# Altium project Headstage_V003.PrjPcb
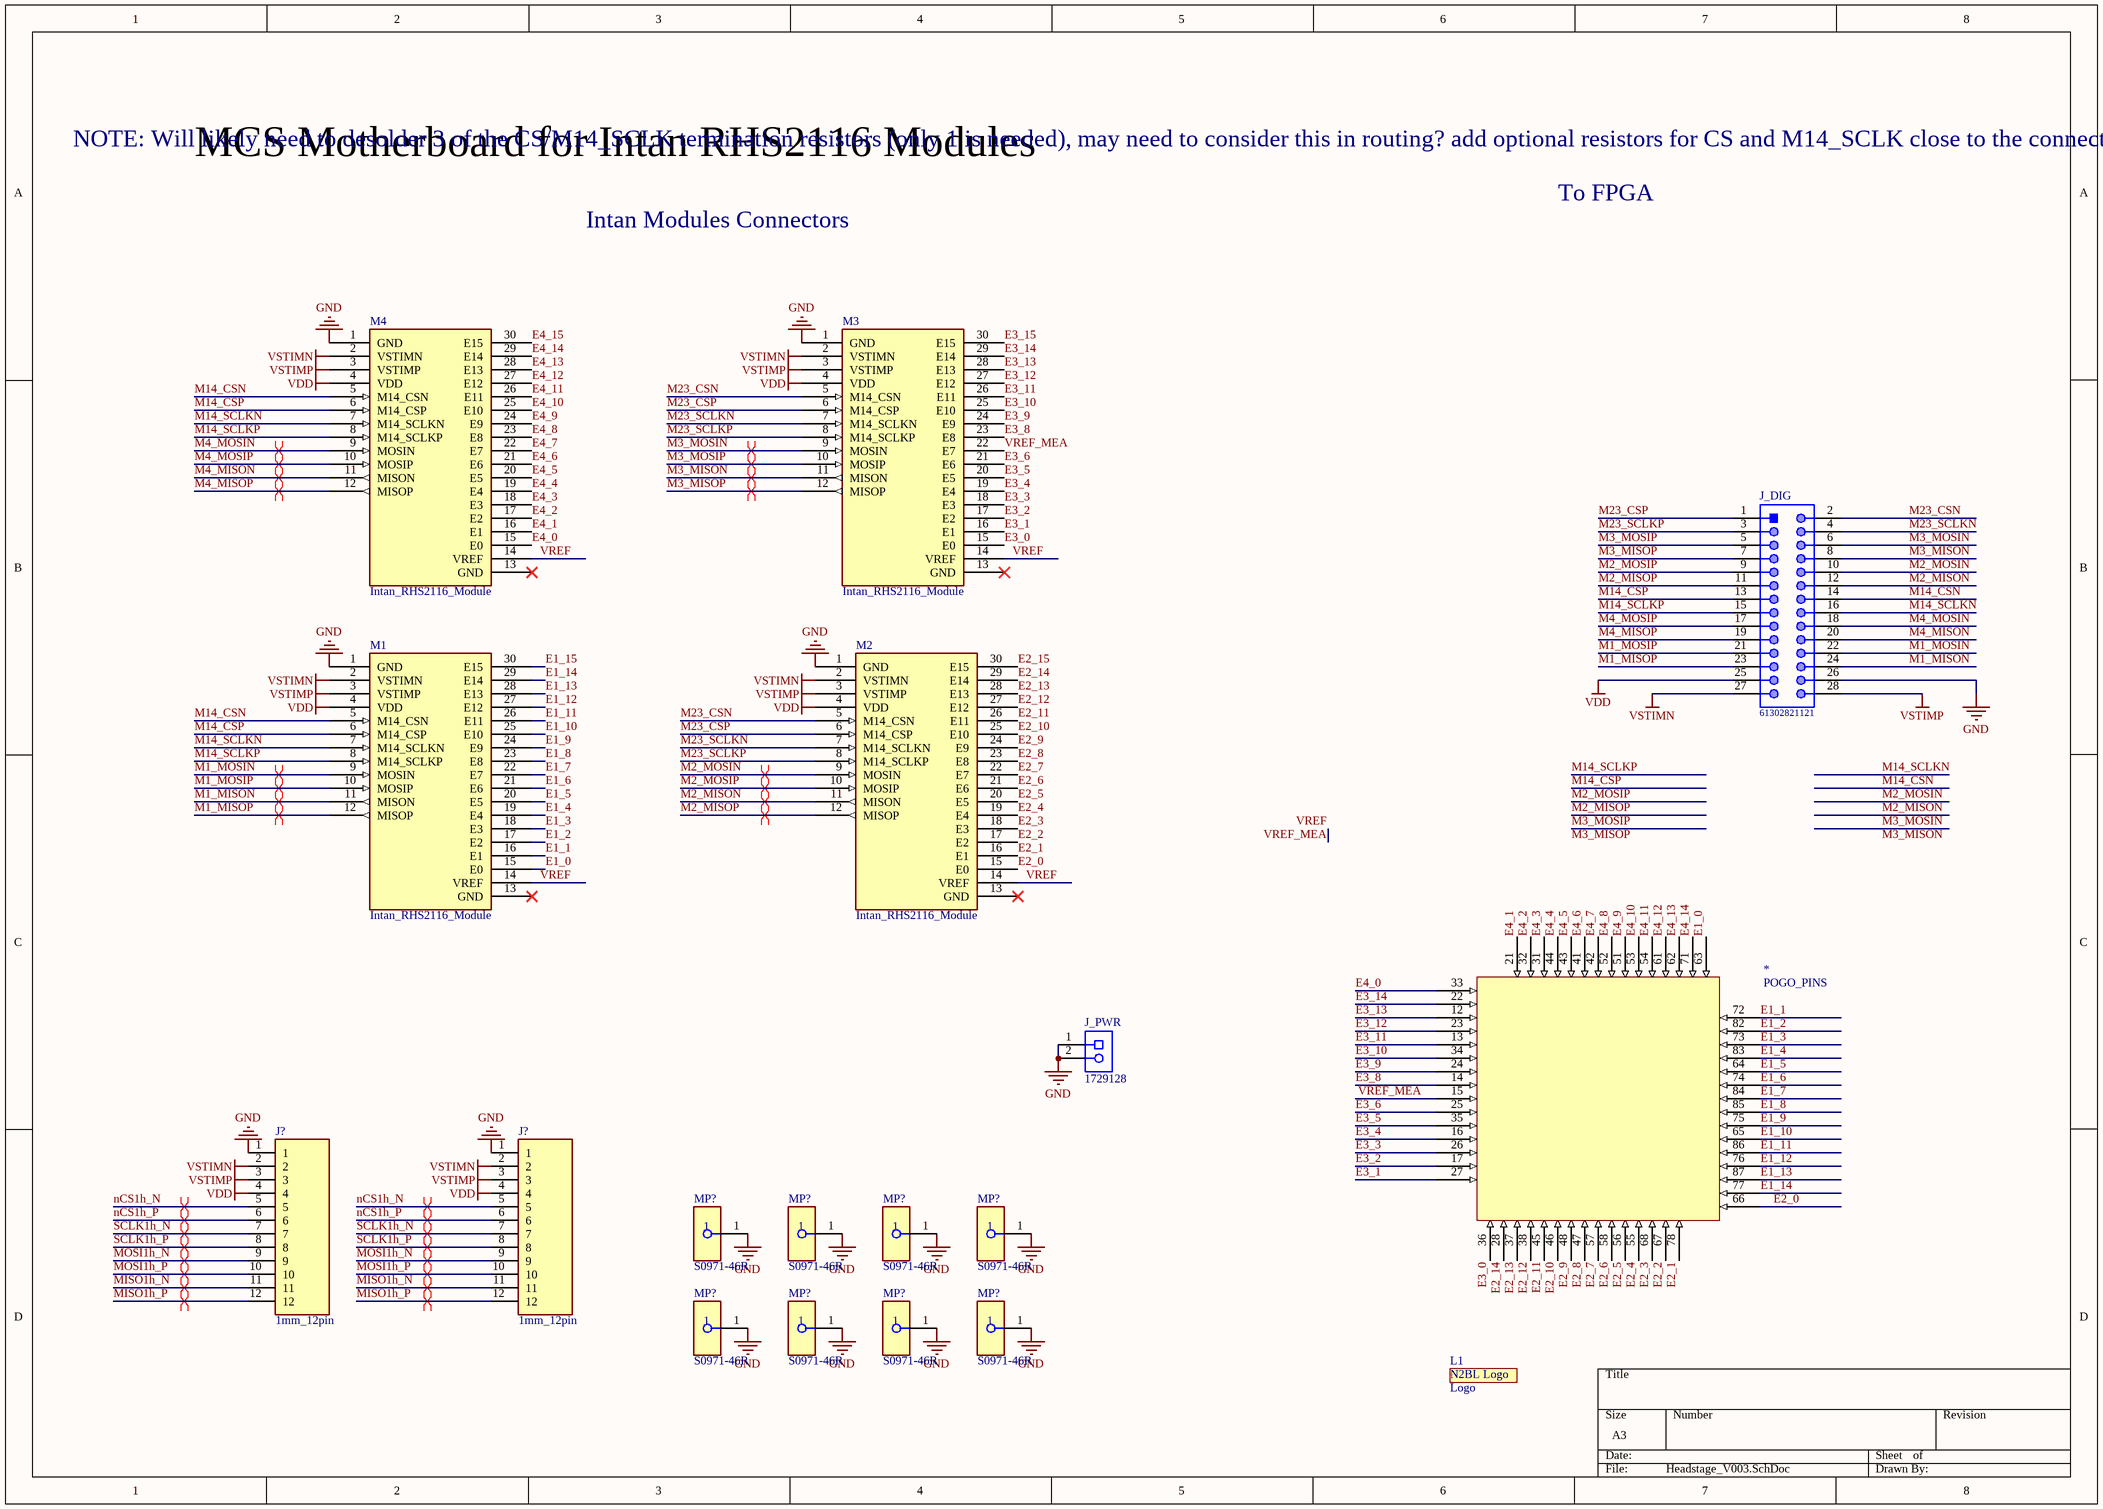
[diagram p0: Headstage_V003.SchDoc]
1 sheet, 18 parts. Net scope: hierarchical (ports join the sheet entries above them; power ports are global).
Board file: Headstage_V003.PcbDoc

## Sheet Headstage_V003.SchDoc
size A3

### Parts
(Parts that share a designator on the sheet are numbered #1, #2 ... from top to bottom, then left to right.)
*  POGO_PINS  [POGO_PINS]
J?#1  1mm_12pin  [1mm_12pin]
J?#2  1mm_12pin  [1mm_12pin]
J_DIG  61302821121  [61302821121]
J_PWR  1729128  [PHOE-1729128-2_V]
L1  Logo  [N2BL_Logo]
M1  Intan_RHS2116_Module  [Intan_RHS2116_Module]
M2  Intan_RHS2116_Module  [Intan_RHS2116_Module]
M3  Intan_RHS2116_Module  [Intan_RHS2116_Module]
M4  Intan_RHS2116_Module  [Intan_RHS2116_Module]
MP?#1  S0971-46R  [FP-S0971-46R-MFG]
MP?#2  S0971-46R  [FP-S0971-46R-MFG]
MP?#3  S0971-46R  [FP-S0971-46R-MFG]
MP?#4  S0971-46R  [FP-S0971-46R-MFG]
MP?#5  S0971-46R  [FP-S0971-46R-MFG]
MP?#6  S0971-46R  [FP-S0971-46R-MFG]
MP?#7  S0971-46R  [FP-S0971-46R-MFG]
MP?#8  S0971-46R  [FP-S0971-46R-MFG]

### Nets
GND: J?#1.1 J?#2.1 J_DIG.26 J_PWR.1 J_PWR.2 M1.1(GND) M2.1(GND) M3.1(GND) M4.1(GND) MP?#1.1 MP?#2.1 MP?#3.1 MP?#4.1 MP?#5.1 MP?#6.1 MP?#7.1 MP?#8.1
VDD: J?#1.4 J?#2.4 J_DIG.25 M1.4(VDD) M2.4(VDD) M3.4(VDD) M4.4(VDD)
VSTIMN: J?#1.2 J?#2.2 J_DIG.27 M1.2(VSTIMN) M2.2(VSTIMN) M3.2(VSTIMN) M4.2(VSTIMN)
VSTIMP: J?#1.3 J?#2.3 J_DIG.28 M1.3(VSTIMP) M2.3(VSTIMP) M3.3(VSTIMP) M4.3(VSTIMP)
E1_0: *.63 M1.15(E0)
E1_1: *.72 M1.16(E1)
E1_2: *.82 M1.17(E2)
E1_3: *.73 M1.18(E3)
E1_4: *.83 M1.19(E4)
E1_5: *.64 M1.20(E5)
E1_6: *.74 M1.21(E6)
E1_7: *.84 M1.22(E7)
E1_8: *.85 M1.23(E8)
E1_9: *.75 M1.24(E9)
E1_10: *.65 M1.25(E10)
E1_11: *.86 M1.26(E11)
E1_12: *.76 M1.27(E12)
E1_13: *.87 M1.28(E13)
E1_14: *.77 M1.29(E14)
E1_15: M1.30(E15)
E2_0: *.66 M2.15(E0)
E2_1: *.78 M2.16(E1)
E2_2: *.67 M2.17(E2)
E2_3: *.68 M2.18(E3)
E2_4: *.55 M2.19(E4)
E2_5: *.56 M2.20(E5)
E2_6: *.58 M2.21(E6)
E2_7: *.57 M2.22(E7)
E2_8: *.47 M2.23(E8)
E2_9: *.48 M2.24(E9)
E2_10: *.46 M2.25(E10)
E2_11: *.45 M2.26(E11)
E2_12: *.38 M2.27(E12)
E2_13: *.37 M2.28(E13)
E2_14: *.28 M2.29(E14)
E2_15: M2.30(E15)
E3_0: *.36 M3.15(E0)
E3_1: *.27 M3.16(E1)
E3_2: *.17 M3.17(E2)
E3_3: *.26 M3.18(E3)
E3_4: *.16 M3.19(E4)
E3_5: *.35 M3.20(E5)
E3_6: *.25 M3.21(E6)
E3_8: *.14 M3.23(E8)
E3_9: *.24 M3.24(E9)
E3_10: *.34 M3.25(E10)
E3_11: *.13 M3.26(E11)
E3_12: *.23 M3.27(E12)
E3_13: *.12 M3.28(E13)
E3_14: *.22 M3.29(E14)
E3_15: M3.30(E15)
E4_0: *.33 M4.15(E0)
E4_1: *.21 M4.16(E1)
E4_2: *.32 M4.17(E2)
E4_3: *.31 M4.18(E3)
E4_4: *.44 M4.19(E4)
E4_5: *.43 M4.20(E5)
E4_6: *.41 M4.21(E6)
E4_7: *.42 M4.22(E7)
E4_8: *.52 M4.23(E8)
E4_9: *.51 M4.24(E9)
E4_10: *.53 M4.25(E10)
E4_11: *.54 M4.26(E11)
E4_12: *.61 M4.27(E12)
E4_13: *.62 M4.28(E13)
E4_14: *.71 M4.29(E14)
E4_15: M4.30(E15)
M1_MISON: J_DIG.24 M1.11(MISON)
M1_MISOP: J_DIG.23 M1.12(MISOP)
M1_MOSIN: J_DIG.22 M1.9(MOSIN)
M1_MOSIP: J_DIG.21 M1.10(MOSIP)
M2_MISON: J_DIG.12 M2.11(MISON)
M2_MISOP: J_DIG.11 M2.12(MISOP)
M2_MOSIN: J_DIG.10 M2.9(MOSIN)
M2_MOSIP: J_DIG.9 M2.10(MOSIP)
M3_MISON: J_DIG.8 M3.11(MISON)
M3_MISOP: J_DIG.7 M3.12(MISOP)
M3_MOSIN: J_DIG.6 M3.9(MOSIN)
M3_MOSIP: J_DIG.5 M3.10(MOSIP)
M4_MISON: J_DIG.20 M4.11(MISON)
M4_MISOP: J_DIG.19 M4.12(MISOP)
M4_MOSIN: J_DIG.18 M4.9(MOSIN)
M4_MOSIP: J_DIG.17 M4.10(MOSIP)
M14_CSN: J_DIG.14 M1.5(M14_CSN) M4.5(M14_CSN)
M14_CSP: J_DIG.13 M1.6(M14_CSP) M4.6(M14_CSP)
M14_SCLKN: J_DIG.16 M1.7(M14_SCLKN) M4.7(M14_SCLKN)
M14_SCLKP: J_DIG.15 M1.8(M14_SCLKP) M4.8(M14_SCLKP)
M23_CSN: J_DIG.2 M2.5(M14_CSN) M3.5(M14_CSN)
M23_CSP: J_DIG.1 M2.6(M14_CSP) M3.6(M14_CSP)
M23_SCLKN: J_DIG.4 M2.7(M14_SCLKN) M3.7(M14_SCLKN)
M23_SCLKP: J_DIG.3 M2.8(M14_SCLKP) M3.8(M14_SCLKP)
MISO1h_N: J?#1.11 J?#2.11
MISO1h_P: J?#1.12 J?#2.12
MOSI1h_N: J?#1.9 J?#2.9
MOSI1h_P: J?#1.10 J?#2.10
nCS1h_N: J?#1.5 J?#2.5
nCS1h_P: J?#1.6 J?#2.6
SCLK1h_N: J?#1.7 J?#2.7
SCLK1h_P: J?#1.8 J?#2.8
VREF: *.15 M1.14(VREF) M2.14(VREF) M3.14(VREF) M3.22(E7) M4.14(VREF)  [also labelled VREF_MEA]

Not connected (* = marked no-connect by the designer): M1 13(GND)*; M2 13(GND)*; M3 13(GND)*; M4 13(GND)*

### Layout directives
differential pair: M1_MISON, M1_MISOP, M1_MOSIN, M1_MOSIP, M2_MISON, M2_MISOP, M2_MOSIN, M2_MOSIP, M3_MISON, M3_MISOP, M3_MOSIN, M3_MOSIP, M4_MISON, M4_MISOP, M4_MOSIN, M4_MOSIP, MISO1h_N, MISO1h_P, MOSI1h_N, MOSI1h_P, nCS1h_N, nCS1h_P, SCLK1h_N, SCLK1h_P

### Notes on the sheet
- NOTE: Will likely need to desolder 3 of the CS/M14_SCLK termination resistors (only 1 is needed), may need to consider this in routing? add optional resistors for CS and M14_SCLK close to the connector?
- MCS Motherboard for Intan RHS2116 Modules
- Intan Modules Connectors
- To FPGA
- Labels drawn without touching a wire or pin: M3_MISON, M3_MISOP
- (in symbol Neuron To Brain Lab Logo) N2BL Logo

### Library data of the parts
J_DIG = CMP-1502-01115-1: THT Vertical Pin Header WR-PHD, Pitch 2.54 mm, Dual Row, 28 pins; Manufacturer: Wurth Elektronik; Pin Number: 28; Contact Resistance: 20mOhm; Withstanding Voltage: 500VAC; Pitch: 2.54mm; Gender: Male; Working Voltage: 250VAC; Rated Current: 3A; Package Reference: 61302821121; Part Number: 61302821121; Mounting Technology: THT; Packaging: Bag; Manufacturer URL: http://www.we-online.de; Row Number: Dual; Orientation: Vertical; Operating Temperature: -40to105degC; Datasheet URL: https://katalog.we-online.de/em/datasheet/6130xx21121.pdf; Publisher: WurthElektronik
J_PWR = CMP-2000-05815-1: PCB Terminal Block, 13.5 A, 400 V, 2-Pin THD, RoHS, Bulk; Manufacturer: Phoenix Contact; Package Version: 03/2015; No. of Rows: 1; Pitch: 5.08mm; No. of Positions: 2; Voltage Rating: 400V; Current Rating: 13500mA; Manufacturer URL: http://www.phoenixcontact.com/; Datasheet URL: https://datasheet.ciiva.com/16046/1729128-16046181.pdf; RoHS: TRUE; Package URL: https://www.phoenixcontact.com/online/portal/pi/pxc/product_detail_page/!ut/p/b1/3VdJjqNKFDxLH8AFycySyWY2ozFsEPOMMQaDOX1XedGL_1Vdm5YXJleknhSKeBkvI6EA8ncAo3AYoDhBQGco6KN7VURTdemj9us_IEKEZo_YHiPAEWEFmDGOHMORkqKYCORBZxgL7ZoaZYcbFFUZ3fqxSY6GOuxydWUuHqz1ynmMFygu583Bob0Ewr6Sd_l-5m-kAueHiB0jpRwZwe58wwtkpxtMYd_LmGcDRU02dRNEyWt6Y2ti5pSyJ_reIkzIulrqApdnbT11V5jnCKbYNCvhEM1MCpPByat_X379-iThf08CI5GfOPqfBeS3BRoBOdD55AKVv0iLwCMq-2BrzXWSGRH7pUGD9uwXQjiph3xL0DKQwdGa0JImiIOmBNOestqgwTHSSs2oOep-78apyXQBvNi8ZLaFjvjWvcaUEBu0MC6Wbe-d6mB0FAebo2lUWinqYaZs5DAYzV0RP9yitUjnGJ0iI9xhZkT42OCQNUJJhkgWINNQLP2JFP6OpMg3JCVg70jqHT0lvKOnhHf0lPuOnnLf0VPuWx6_dxwUIvwk5WMkT0kLL1mh61l2yZVSzG3pYV_bqo-mj6uMKwKwdnnW8Jh5RTOJzMOA5c-eJDaZQw4mTMPH02PvS_ZAqNVjVTo2WyYLkwH_KU1mmmG5kjRhDqPXLwwVHvVOjCM60-fpXvTDfMGW1PVFVS1r4e4yVDk4ZdNbkUHvqPqQSeian4UD39fNKmachqdJ1NJbyk8rXT9mXTvPk3oE5meulKGgiruPJek-4I9hTT6G8ZLOyRSm2RRVbThERQad5OS28hdt4YW4vG0stgYYzsWsK4_7y6DZMjJSCqri1kyiZR5vD7pwIrNR7QwPHTcLTI5qT7eRlpHrdGiupYlqQDJ7zy_CND8fWWBoLRXxk1RVcXiBQwbTD4Xi7KL-FuO94t9xaqweXzH; PartNumber: 1729128; Package Description: 2-Pin Through Hole Device, Body 8.1 x 10.16 mm, Pitch 5.08 mm; Datasheet Version: 12/2013; Mounting Technology: ThroughHole; Orientation: Horizontal; Package Reference: 1729128-2; Packing: Bulk
L1 = Neuron To Brain Lab Logo
MP?#1-MP?#8 = CMP-15817-000004-1: RFI SHIELD CLIP MINI TIN SMD; Manufacturer: Harwin; Is Female: yes; Number Of Contacts: 1; Conn Orientation: Vertical; Description: CLIP, RFI SHIELD CAN, 2MM HIGH; ComponentLink2URL: https://cdn.harwin.com/pdfs/S0971-46R.pdf; Digikey Description: RFI SHIELD CLIP MINI TIN SMD; ComponentLink2Description: Datasheet; Height: 2.1mm; Mouser Description: EZ-Shield Clip, SMT, Mini, Stainless Steel, tin, Tape & Reeled; Contact Material: Tin,Nickel; RoHS: TRUE; Device Class L1: Connectors; Lead Free: Yes; Package: S0971-46R; Manufacturer Part Number: S0971-46R; Temperature Range High: +150°C; Device Class L2: unset; Category: UNK; Octopart: https://octopart.com/s0971-46r-harwin-30988305; Temperature Range Low: -25°C; Device Class L3: unset; Automotive: No; Temperature: -25°C to +150°C